# EAGLE design 6x6 (EAGLE 6.5.0)

## Sheet 1 of 2
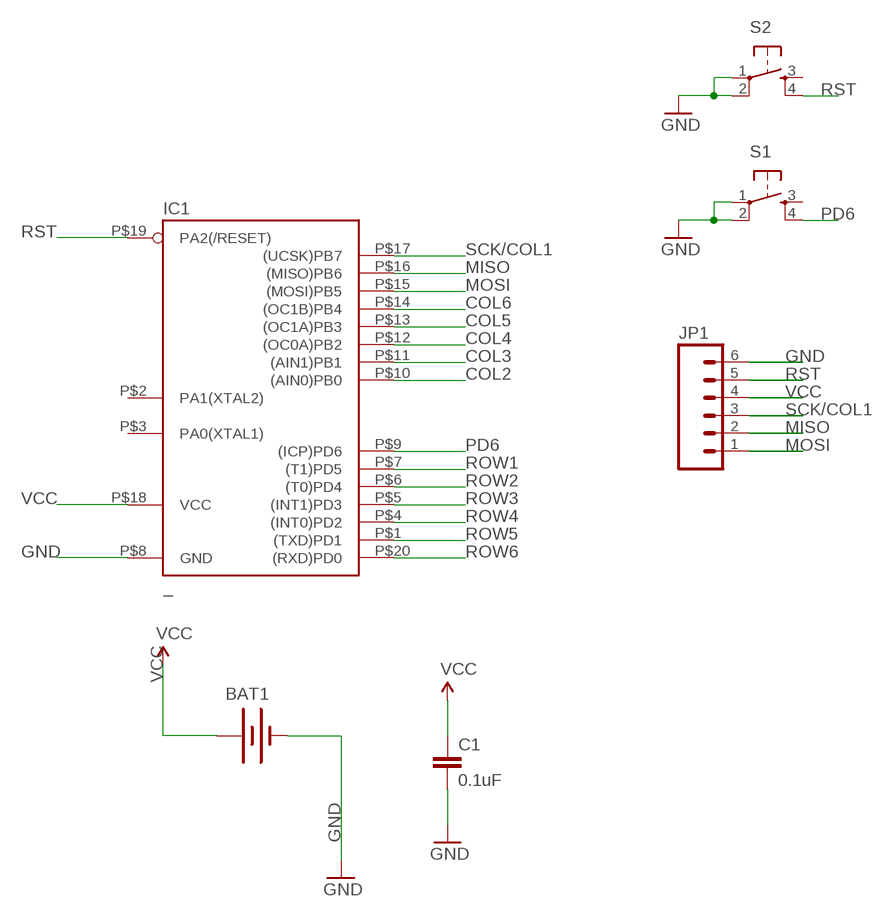
[diagram p0: schematic, sheet 1]

### Parts
BAT1  BATTERY245MM  [BATTCON_245MM]
C1  0.1uF  CAP0805  [0805]
IC1  _  TINY2313-*M*  [MLF20]
JP1  M061X06-SMD_EDGE_FEMALE  [1X06-SMD_EDGE]
S1  TAC_SWITCHSMD  [TACTILE_SWITCH_SMD]
S2  TAC_SWITCHSMD  [TACTILE_SWITCH_SMD]

### Nets
COL2: IC1.P$10((AIN0)PB0) ; also sheet 2
COL3: IC1.P$11((AIN1)PB1) ; also sheet 2
COL4: IC1.P$12((OC0A)PB2) ; also sheet 2
COL5: IC1.P$13((OC1A)PB3) ; also sheet 2
COL6: IC1.P$14((OC1B)PB4) ; also sheet 2
GND: BAT1.2(-) C1.2 IC1.P$8(GND) JP1.6 S1.1 S1.2 S2.1 S2.2 ; also sheet 2
MISO: IC1.P$16((MISO)PB6) JP1.2
MOSI: IC1.P$15((MOSI)PB5) JP1.1
PD6: IC1.P$9((ICP)PD6) S1.4
ROW1: IC1.P$7((T1)PD5) ; also sheet 2
ROW2: IC1.P$6((T0)PD4) ; also sheet 2
ROW3: IC1.P$5((INT1)PD3) ; also sheet 2
ROW4: IC1.P$4((INT0)PD2) ; also sheet 2
ROW5: IC1.P$1((TXD)PD1) ; also sheet 2
ROW6: IC1.P$20((RXD)PD0) ; also sheet 2
RST: IC1.P$19(PA2(/RESET)) JP1.5 S2.4
SCK/COL1: IC1.P$17((UCSK)PB7) JP1.3 ; also sheet 2
VCC: BAT1.3(+) C1.1 IC1.P$18(VCC) JP1.4 ; also sheet 2
Unconnected: IC1.P$2(PA1(XTAL2)) IC1.P$3(PA0(XTAL1)) S1.3 S2.3

## Sheet 2 of 2
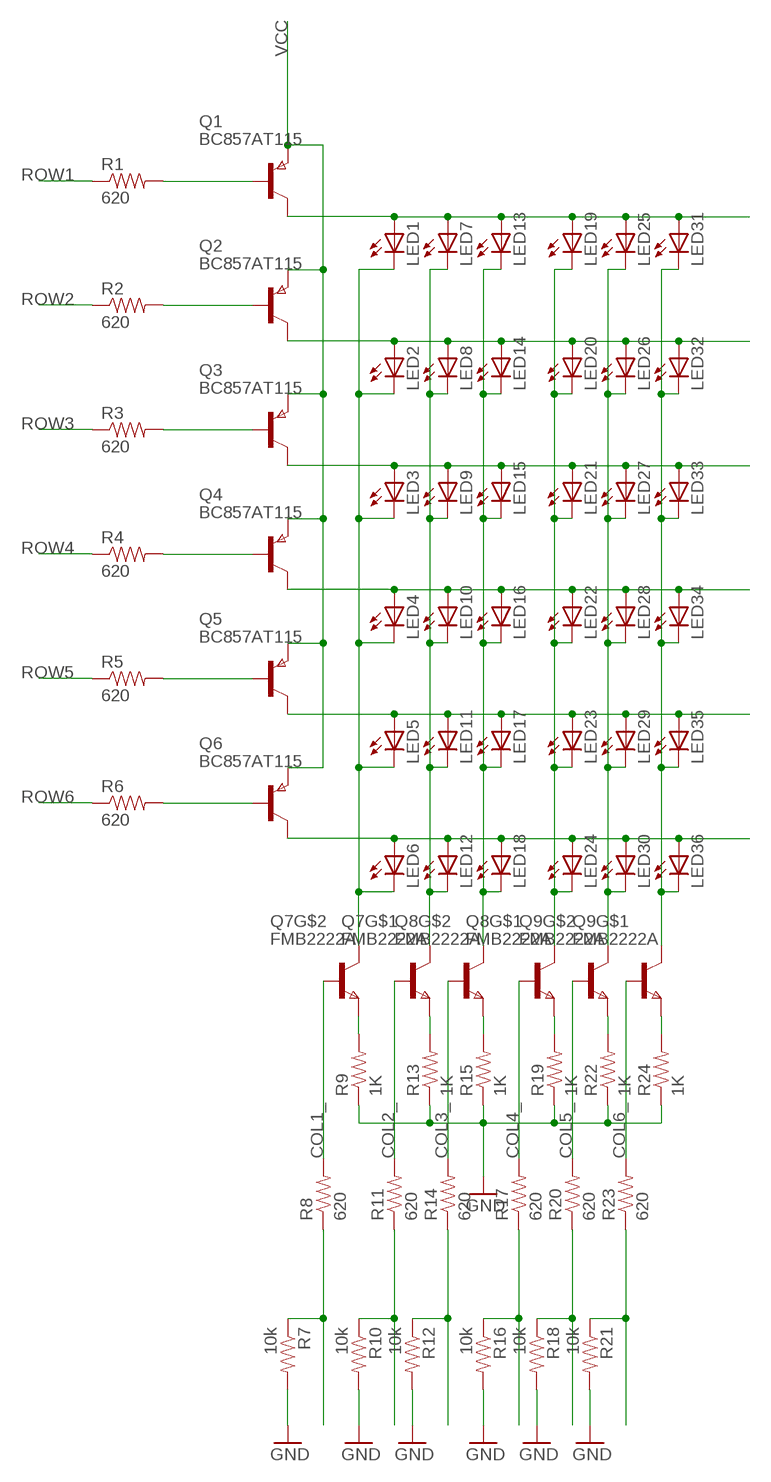
[diagram p1: schematic, sheet 2]

### Parts
LED1  LEDCHIPLED_1206  [CHIPLED_1206]
LED2  LEDCHIPLED_1206  [CHIPLED_1206]
LED3  LEDCHIPLED_1206  [CHIPLED_1206]
LED4  LEDCHIPLED_1206  [CHIPLED_1206]
LED5  LEDCHIPLED_1206  [CHIPLED_1206]
LED6  LEDCHIPLED_1206  [CHIPLED_1206]
LED7  LEDCHIPLED_1206  [CHIPLED_1206]
LED8  LEDCHIPLED_1206  [CHIPLED_1206]
LED9  LEDCHIPLED_1206  [CHIPLED_1206]
LED10  LEDCHIPLED_1206  [CHIPLED_1206]
LED11  LEDCHIPLED_1206  [CHIPLED_1206]
LED12  LEDCHIPLED_1206  [CHIPLED_1206]
LED13  LEDCHIPLED_1206  [CHIPLED_1206]
LED14  LEDCHIPLED_1206  [CHIPLED_1206]
LED15  LEDCHIPLED_1206  [CHIPLED_1206]
LED16  LEDCHIPLED_1206  [CHIPLED_1206]
LED17  LEDCHIPLED_1206  [CHIPLED_1206]
LED18  LEDCHIPLED_1206  [CHIPLED_1206]
LED19  LEDCHIPLED_1206  [CHIPLED_1206]
LED20  LEDCHIPLED_1206  [CHIPLED_1206]
LED21  LEDCHIPLED_1206  [CHIPLED_1206]
LED22  LEDCHIPLED_1206  [CHIPLED_1206]
LED23  LEDCHIPLED_1206  [CHIPLED_1206]
LED24  LEDCHIPLED_1206  [CHIPLED_1206]
LED25  LEDCHIPLED_1206  [CHIPLED_1206]
LED26  LEDCHIPLED_1206  [CHIPLED_1206]
LED27  LEDCHIPLED_1206  [CHIPLED_1206]
LED28  LEDCHIPLED_1206  [CHIPLED_1206]
LED29  LEDCHIPLED_1206  [CHIPLED_1206]
LED30  LEDCHIPLED_1206  [CHIPLED_1206]
LED31  LEDCHIPLED_1206  [CHIPLED_1206]
LED32  LEDCHIPLED_1206  [CHIPLED_1206]
LED33  LEDCHIPLED_1206  [CHIPLED_1206]
LED34  LEDCHIPLED_1206  [CHIPLED_1206]
LED35  LEDCHIPLED_1206  [CHIPLED_1206]
LED36  LEDCHIPLED_1206  [CHIPLED_1206]
Q1  BC857AT115  PNPSOT323SOT416  [SOT416]
Q2  BC857AT115  PNPSOT323SOT416  [SOT416]
Q3  BC857AT115  PNPSOT323SOT416  [SOT416]
Q4  BC857AT115  PNPSOT323SOT416  [SOT416]
Q5  BC857AT115  PNPSOT323SOT416  [SOT416]
Q6  BC857AT115  PNPSOT323SOT416  [SOT416]
Q7  FMB2222A  DUALNPN  [SSOT6]
Q8  FMB2222A  DUALNPN  [SSOT6]
Q9  FMB2222A  DUALNPN  [SSOT6]
R1  620  SPARKFUN_RESISTOR0402-RES  [SPARKFUN_0402-RES]
R2  620  SPARKFUN_RESISTOR0603-RES  [SPARKFUN_0603-RES]
R3  620  SPARKFUN_RESISTOR0603-RES  [SPARKFUN_0603-RES]
R4  620  SPARKFUN_RESISTOR0603-RES  [SPARKFUN_0603-RES]
R5  620  SPARKFUN_RESISTOR0603-RES  [SPARKFUN_0603-RES]
R6  620  SPARKFUN_RESISTOR0603-RES  [SPARKFUN_0603-RES]
R7  10k  SPARKFUN_RESISTOR0603-RES  [SPARKFUN_0603-RES]
R8  620  SPARKFUN_RESISTOR0603-RES  [SPARKFUN_0603-RES]
R9  1K  SPARKFUN_RESISTOR0603-RES  [SPARKFUN_0603-RES]
R10  10k  SPARKFUN_RESISTOR0603-RES  [SPARKFUN_0603-RES]
R11  620  SPARKFUN_RESISTOR0603-RES  [SPARKFUN_0603-RES]
R12  10k  SPARKFUN_RESISTOR0603-RES  [SPARKFUN_0603-RES]
R13  1K  SPARKFUN_RESISTOR0603-RES  [SPARKFUN_0603-RES]
R14  620  SPARKFUN_RESISTOR0603-RES  [SPARKFUN_0603-RES]
R15  1K  SPARKFUN_RESISTOR0603-RES  [SPARKFUN_0603-RES]
R16  10k  SPARKFUN_RESISTOR0603-RES  [SPARKFUN_0603-RES]
R17  620  SPARKFUN_RESISTOR0603-RES  [SPARKFUN_0603-RES]
R18  10k  SPARKFUN_RESISTOR0603-RES  [SPARKFUN_0603-RES]
R19  1K  SPARKFUN_RESISTOR0603-RES  [SPARKFUN_0603-RES]
R20  620  SPARKFUN_RESISTOR0603-RES  [SPARKFUN_0603-RES]
R21  10k  SPARKFUN_RESISTOR0603-RES  [SPARKFUN_0603-RES]
R22  1K  SPARKFUN_RESISTOR0603-RES  [SPARKFUN_0603-RES]
R23  620  SPARKFUN_RESISTOR0603-RES  [SPARKFUN_0603-RES]
R24  1K  SPARKFUN_RESISTOR0603-RES  [SPARKFUN_0603-RES]

### Nets
COL1_: Q7.3(B) R8.2
COL2: R10.1 R11.1 ; also sheet 1
COL2_: Q7.1(B) R11.2
COL3: R12.1 R14.1 ; also sheet 1
COL3_: Q8.3(B) R14.2
COL4: R16.1 R17.1 ; also sheet 1
COL4_: Q8.1(B) R17.2
COL5: R18.1 R20.1 ; also sheet 1
COL5_: Q9.3(B) R20.2
COL6: R21.1 R23.1 ; also sheet 1
COL6_: Q9.1(B) R23.2
GND: R7.2 R9.1 R10.2 R12.2 R13.1 R15.1 R16.2 R18.2 R19.1 R21.2 R22.1 R24.1 ; also sheet 1
LINE1: LED1.A LED7.A LED13.A LED19.A LED25.A LED31.A Q1.1(C)
LINE2: LED2.A LED8.A LED14.A LED20.A LED26.A LED32.A Q2.1(C)
LINE3: LED3.A LED9.A LED15.A LED21.A LED27.A LED33.A Q3.1(C)
LINE4: LED4.A LED10.A LED16.A LED22.A LED28.A LED34.A Q4.1(C)
LINE5: LED5.A LED11.A LED17.A LED23.A LED29.A LED35.A Q5.1(C)
LINE6: LED6.A LED12.A LED18.A LED24.A LED30.A LED36.A Q6.1(C)
N$1: Q2.2(B) R2.2
N$2: Q1.2(B) R1.2
N$3: Q5.2(B) R5.2
N$4: Q3.2(B) R3.2
N$5: Q4.2(B) R4.2
N$6: Q6.2(B) R6.2
N$7: LED19.C LED20.C LED21.C LED22.C LED23.C LED24.C Q8.6(C)
N$8: LED25.C LED26.C LED27.C LED28.C LED29.C LED30.C Q9.4(C)
N$9: LED31.C LED32.C LED33.C LED34.C LED35.C LED36.C Q9.6(C)
N$10: Q7.2(E) R9.2
N$11: Q9.5(E) R24.2
N$12: Q9.2(E) R22.2
N$13: Q8.5(E) R19.2
N$14: Q8.2(E) R15.2
N$15: Q7.5(E) R13.2
N$40: LED1.C LED2.C LED3.C LED4.C LED5.C LED6.C Q7.4(C)
N$41: LED7.C LED8.C LED9.C LED10.C LED11.C LED12.C Q7.6(C)
N$42: LED13.C LED14.C LED15.C LED16.C LED17.C LED18.C Q8.4(C)
ROW1: R1.1 ; also sheet 1
ROW2: R2.1 ; also sheet 1
ROW3: R3.1 ; also sheet 1
ROW4: R4.1 ; also sheet 1
ROW5: R5.1 ; also sheet 1
ROW6: R6.1 ; also sheet 1
SCK/COL1: R7.1 R8.1 ; also sheet 1
VCC: Q1.3(E) Q2.3(E) Q3.3(E) Q4.3(E) Q5.3(E) Q6.3(E) ; also sheet 1

## Library data of the parts
BAT1 = 6x6:BATTERY: Battery Holders Various common sizes : AA, AAA, 20mm coin cell and 12mm coin cell.
C1 = SparkFun:CAP: Capacitor Standard 0603 ceramic capacitor, and 0.1" leaded capacitor.
IC1 = NSL_Cylon:TINY2313*: Atmel Tiny2313 2K Flash, 128 bytes EEPROM, 128 bytes RAM
JP1 = SparkFun:M06: Header 6 Standard 6-pin 0.1" header. Use with straight break away headers (SKU : PRT-00116), right angle break away headers (PRT-00553), swiss pins (PRT-00743), machine pins (PRT-00117), and female headers (PRT-00115). Molex polarized connector foot print use with SKU : PRT-08094 with associated crimp pins and housings. NOTES ON THE VARIANTS LOCK and LOCK_LONGPADS... This footprint was designed to help hold the alignment of a through-hole component (i.e. 6-pin header) while soldering it into place. You may notice that each hole has been shifted either up or down by 0.005 of an inch from it's more standard position (which is a perfectly straight line). This slight alteration caused the pins (the squares in the middle) to touch the edges of the holes. Because they are alternating, it causes a "brace" to hold the component in place. 0.005 has proven to be the perfect amount of "off-center" position when using our standard breakaway headers. Although looks a little odd when you look at the bare footprint, once you have a header in there, the alteration is very hard to notice. Also, if you push a header all the way into place, it is covered up entirely on the bottom side. This idea of altering the position of holes to aid alignment will be further integrated into the Sparkfun Library for other footprints. It can help hold any component with 3 or more connection pins.
LED1-LED36 = led:LED: LED OSRAM: - CHIPLED LG R971, LG N971, LY N971, LG Q971, LY Q971, LO R971, LY R971 LH N974, LH R974 LS Q976, LO Q976, LY Q976 LO Q996 - Hyper CHIPLED LW Q18S LB Q993, LB Q99A, LB R99A - SideLED LS A670, LO A670, LY A670, LG A670, LP A670 LB A673, LV A673, LT A673, LW A673 LH A674 LY A675 LS A676, LA A676, LO A676, LY A676, LW A676 LS A679, LY A679, LG A679 - Hyper Micro SIDELED® LS Y876, LA Y876, LO Y876, LY Y876 LT Y87S - SmartLED LW L88C, LW L88S LB L89C, LB L89S, LG L890 LS L89K, LO L89K, LY L89K LS L896, LA L896, LO L896, LY L896 - TOPLED LS T670, LO T670, LY T670, LG T670, LP T670 LSG T670, LSP T670, LSY T670, LOP T670, LYG T670 LG T671, LOG T671, LSG T671 LB T673, LV T673, LT T673, LW T673 LH T674 LS T676, LA T676, LO T676, LY T676, LB T676, LH T676, LSB T676, LW T676 LB T67C, LV T67C, LT T67C, LS T67K, LO T67K, LY T67K, LW E67C LS E67B, LA E67B, LO E67B, LY E67B, LB E67C, LV E67C, LT E67C LW T67C LS T679, LY T679, LG T679 LS T770, LO T770, LY T770, LG T770, LP T770 LB T773, LV T773, LT T773, LW T773 LH T774 LS E675, LA E675, LY E675, LS T675 LS T776, LA T776, LO T776, LY T776, LB T776 LHGB T686 LT T68C, LB T68C - Hyper Mini TOPLED® LB M676 - Mini TOPLED Santana® LG M470 LS M47K, LO M47K, LY M47K Source: http://www.osram.convergy.de LUXEON: - LUMILED® LXK2-PW12-R00, LXK2-PW12-S00, LXK2-PW14-U00, LXK2-PW14-V00 LXK2-PM12-R00, LXK2-PM12-S00, LXK2-PM14-U00 LXK2-PE12-Q00, LXK2-PE12-R00, LXK2-PE12-S00, LXK2-PE14-T00, LXK2-PE14-U00 LXK2-PB12-K00, LXK2-PB12-L00, LXK2-PB12-M00, LXK2-PB14-N00, LXK2-PB14-P00, LXK2-PB14-Q00 LXK2-PR12-L00, LXK2-PR12-M00, LXK2-PR14-Q00, LXK2-PR14-R00 LXK2-PD12-Q00, LXK2-PD12-R00, LXK2-PD12-S00 LXK2-PH12-R00, LXK2-PH12-S00 LXK2-PL12-P00, LXK2-PL12-Q00, LXK2-PL12-R00 Source: www.luxeon.com KINGBRIGHT: KA-3528ASYC Source: www.kingbright.com
Q1-Q6 = zetex:PNPSOT323: PNP TRANSISTOR
Q7-Q9 = fairchild-semic:DUALNPN
R1-R24 = Nullspace:SPARKFUN_RESISTOR: Resistor Basic schematic elements and footprints for 0603, 1206, and PTH 1/10th watt (small) resistors.
S1 S2 = SparkFun:TAC_SWITCH: Momentary Switch Button commonly used for reset or general input. Spark Fun Electronics SKU : COM-00097

## Net classes
1 power: width 0.254 mm
2 leds: width 0.508 mm

## Board
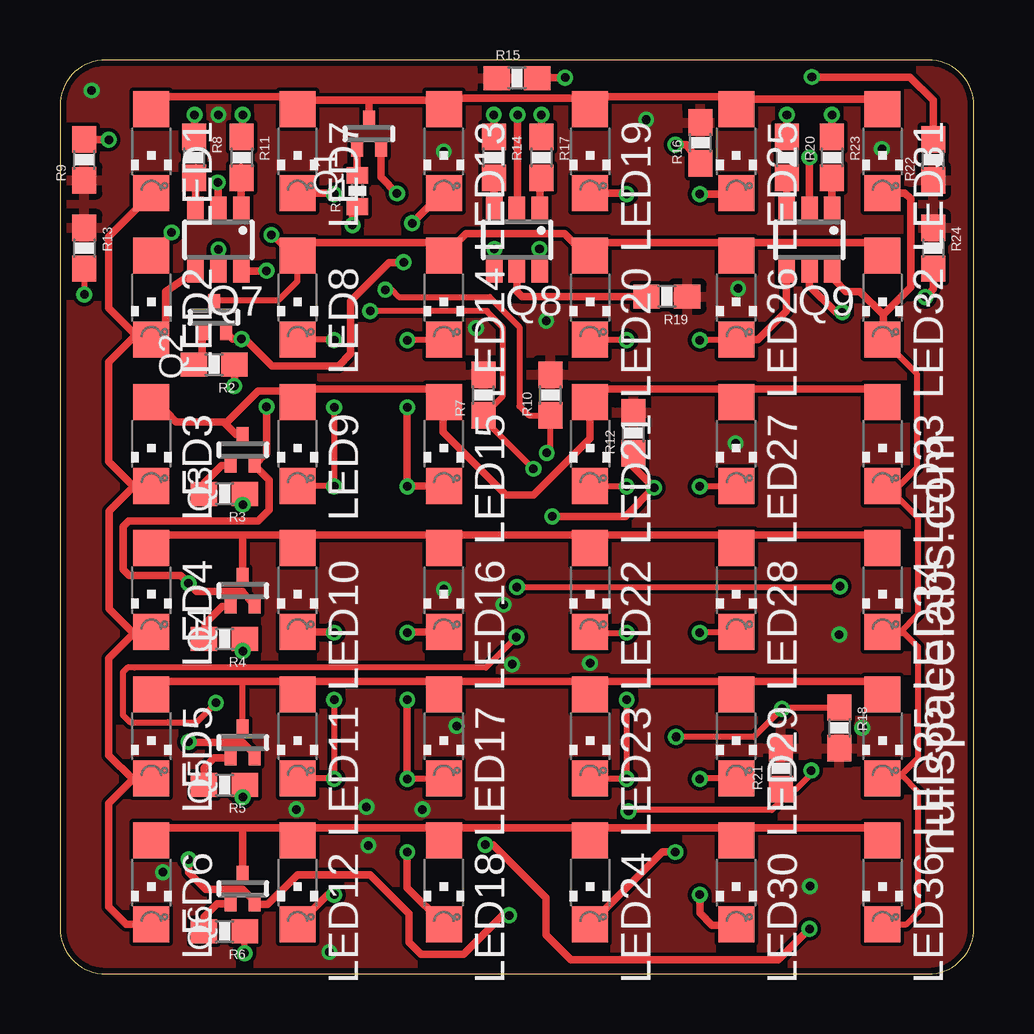
[diagram p2: board, top side]
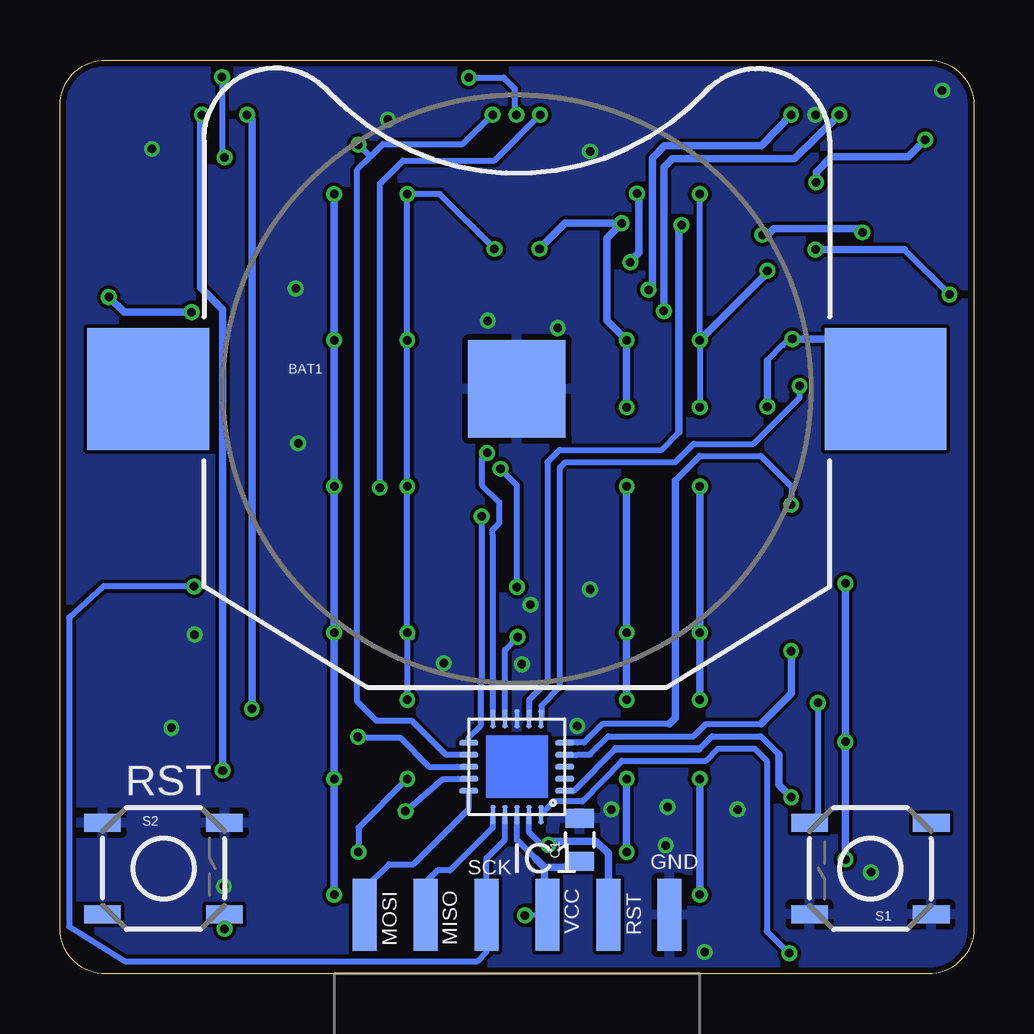
[diagram p3: board, bottom side, seen from below]

Size 38.1 x 38.1 mm. Coordinates in mm from the lower left corner, seen from the top.
Outline: 0,36.2 0,1.91 arc90 1.91,0 36.2,0 arc90 38.1,1.91 38.1,36.2 arc90 36.2,38.1 1.91,38.1 arc90 0,36.2
Copper layers (1*16): Top 0.035mm / dielectric 1.5mm / Bottom 0.035mm
Design rules "ITEADstudio_DRC": minimum track width 6mil, minimum drill 12mil, track to track 6mil, track to pad 6mil, pad to pad 6mil, via to via 6mil, smd to smd 0mil, copper to edge 10mil, drill to drill 10mil, minimum pad ring 10mil, minimum via ring 6mil, stop-mask expansion 2mil, vias tented up to drill 100mil, thermal gap 10mil

### Footprints (pad centres in the part's own frame; a part is rotated, then mirrored left to right if it is on the bottom)
BATTCON_245MM = smd 5.08 x 5.08: 1 -15.367,0; 3 15.367,0 | smd 4.064 x 4.064: 2 0,0
0805 = smd 0.8 x 1.2: 1 -0.9,0; 2 0.9,0
MLF20 = smd 0.8 x 0.23: P$1 -2,1; P$2 -2,0.5; P$3 -2,0; P$4 -2,-0.5; P$5 -2,-1; P$11 2,-1; P$12 2,-0.5; P$13 2,0; P$14 2,0.5; P$15 2,1 | smd 0.23 x 0.8: P$6 -1,-2; P$7 -0.5,-2; P$8 0,-2; P$9 0.5,-2; P$10 1,-2; P$16 1,2; P$17 0.5,2; P$18 0,2; P$19 -0.5,2; P$20 -1,2
1X06-SMD_EDGE = smd 1 x 3: 1 0,-0.08; 2 2.54,-0.08; 3 5.08,-0.08; 4 7.62,-0.08; 5 10.16,-0.08; 6 12.7,-0.08
CHIPLED_1206 = smd 1.5 x 1.5: A 0,-1.75; C 0,1.75
SOT416 = smd 0.6 x 0.5: 1 -0.65,0; 2 0.65,-0.5; 3 0.65,0.5
SSOT6 = smd 0.69 x 0.99: 1 -0.95,-1.3; 2 0,-1.3; 3 0.95,-1.3; 4 0.95,1.3; 5 0,1.3; 6 -0.95,1.3
SPARKFUN_0402-RES = smd 0.7 x 0.9: 1 -0.65,0; 2 0.65,0
SPARKFUN_0603-RES = smd 1.1 x 1: 1 -0.85,0; 2 0.85,0
TACTILE_SWITCH_SMD = smd 1.524 x 0.762: 1 -2.54,1.905; 2 2.54,1.905; 3 -2.54,-1.905; 4 2.54,-1.905

### Placement (x,y rotation side)
BAT1  19.05,24.38 0 bottom
C1  16.43,5.59 90 bottom
IC1  19.05,8.64 180 bottom
JP1  25.4,2.54 0 bottom
LED1  3.81,34.29 180 top
LED2  3.81,28.19 180 top
LED3  3.81,22.1 180 top
LED4  3.81,16 180 top
LED5  3.81,9.91 180 top
LED6  3.81,3.81 180 top
LED7  9.91,34.29 180 top
LED8  9.91,28.19 180 top
LED9  9.91,22.1 180 top
LED10  9.91,16 180 top
LED11  9.91,9.91 180 top
LED12  9.91,3.81 180 top
LED13  16,34.29 180 top
LED14  16,28.19 180 top
LED15  16,22.1 180 top
LED16  16,16 180 top
LED17  16,9.91 180 top
LED18  16,3.81 180 top
LED19  22.1,34.29 180 top
LED20  22.1,28.19 180 top
LED21  22.1,22.1 180 top
LED22  22.1,16 180 top
LED23  22.1,9.91 180 top
LED24  22.1,3.81 180 top
LED25  28.19,34.29 180 top
LED26  28.19,28.19 180 top
LED27  28.19,22.1 180 top
LED28  28.19,16 180 top
LED29  28.19,9.91 180 top
LED30  28.19,3.81 180 top
LED31  34.29,34.29 180 top
LED32  34.29,28.19 180 top
LED33  34.29,22.1 180 top
LED34  34.29,16 180 top
LED35  34.29,9.91 180 top
LED36  34.29,3.81 180 top
Q1  12.88,35.03 270 top
Q2  6.43,27.38 270 top
Q3  7.62,21.84 270 top
Q4  7.62,15.98 270 top
Q5  7.62,9.65 270 top
Q6  7.62,3.56 270 top
Q7  6.6,30.61 180 top
Q8  19.05,30.61 180 top
Q9  31.24,30.61 180 top
R1  12.4,32.64 90 top
R2  6.43,25.4 180 top
R3  6.86,20.02 180 top
R4  6.86,13.97 180 top
R5  6.86,7.87 180 top
R6  6.86,1.78 180 top
R7  17.65,24.13 90 top
R8  5.59,34.04 270 top
R9  1.02,33.93 90 top
R10  20.45,24.13 90 top
R11  7.57,34.04 270 top
R12  23.9,22.56 90 top
R13  1.02,30.25 270 top
R14  18.08,34.04 270 top
R15  19.05,37.34 0 top
R16  26.7,34.65 90 top
R17  20.07,34.04 270 top
R18  32.49,10.26 270 top
R19  25.3,28.24 180 top
R20  30.3,34.04 270 top
R21  30.05,8.56 90 top
R22  36.4,33.93 90 top
R23  32.18,34.04 270 top
R24  36.4,30.25 270 top
S1  4.32,4.39 180 bottom
S2  33.78,4.39 0 bottom

### Tracks (layer width: path | path; a pad name or v marks a point on that pad's centre or on a via)
COL1_
  Top 0.254: R8.2 5.65,33.6
  Top 0.305: 5.65,33.6 Q7.3
COL2  (via drill 0.36)
  Top 0.254: v13.56,28.52 13.82,28.52 14.12,28.22 17.91,28.22 19.15,26.98 19.15,23.67 19.54,23.28 R10.1 | 7.62,34.99 R11.1 | R10.1 20.61,23.47 | 20.61,23.27 R10.1 | v20.3,21.72 20.45,21.87 R10.1
  Top 0.305: v7.62,35.81 7.62,34.99
  Bottom 0.203: 20.07,10.65 IC1.P$10
  Bottom 0.254: v13.56,28.52 13.41,28.68 | v20.3,21.72 20.5,21.51 20.5,20.37 19.79,19.66 19.79,18.8 20.07,18.52 20.07,18.29 20.07,11.18 20.07,10.65 IC1.P$10
  Bottom 0.305: 13.41,28.68 13.41,34.01 12.9,34.52 8.87,34.52 v7.62,35.81
COL2_
  Top 0.254: R11.2 7.55,33.62
  Top 0.305: 7.55,33.62 Q7.1
COL3  (via drill 0.36)
  Top 0.305: v20.52,19.07 23.57,19.07 v24.77,20.27 23.9,21.13 R12.1 | v18.09,35.81 R14.1
  Bottom 0.203: 21.08,9.63 IC1.P$11
  Bottom 0.254: 21.08,9.63 21.08,9.83 20.57,10.34 20.57,12.14 20.52,12.19 v20.52,19.07 | v24.77,20.27 24.77,32.94 23.8,33.91 19.99,33.91 v18.09,35.81
COL3_
  Top 0.305: R14.2 18.1,33.17 Q8.3
COL4  (via drill 0.36)
  Top 0.305: v20.07,35.81 R17.1 | R16.1 26.12,34.57 v25.65,34.57
  Bottom 0.203: IC1.P$12
  Bottom 0.254: 25.16,34.07 25.71,33.53 25.71,11.35 24.92,10.57 23.44,10.57 22.02,9.14 21.51,9.14 IC1.P$12 | 25.16,34.07 24.64,34.59 21.31,34.59 v20.07,35.81 | 25.16,34.07 v25.65,34.57
COL4_
  Top 0.305: R17.2 20,33.12 Q8.1
COL5  (via drill 0.36)
  Top 0.254: v25.68,9.88 28.93,9.88 v30.1,11.05 | v30.1,11.05 30.19,11.14 | R18.1 30.16,11.11 v30.1,11.05
  Top 0.305: v30.3,35.81 R20.1
  Bottom 0.254: IC1.P$13 21.54,8.64 22.71,8.64 23.93,9.86 25.65,9.86 v25.68,9.88
  Bottom 0.305: v30.1,11.05 30.1,35.61 v30.3,35.81
COL5_
  Top 0.305: Q9.3 30.3,32.54 R20.2
COL6  (via drill 0.36)
  Top 0.254: R21.1 29.95,7.81 | R21.1 30.7,7.71 31.32,8.33 v31.32,8.48 | v23.7,6.78 23.75,6.83 29.67,6.83 30.05,7.21 R21.1
  Top 0.305: v32.18,35.81 R23.1
  Bottom 0.203: 21.51,8.13 21.51,8.14
  Bottom 0.254: 21.51,8.14 IC1.P$14 | 21.51,8.13 22.12,8.13 v23.7,6.78
  Bottom 0.305: v32.18,35.81 32.23,35.76 32.23,28.6 31.32,27.69 v31.32,8.48
COL6_
  Top 0.305: Q9.1 32.18,32.54 R23.2
GND  (via drill 0.36)
  other vias: 18.49,15.39 12.78,6.96 20.27,27.23 6.6,35.81 17.35,26.92 15.11,6.86 1.32,36.83 28.27,28.58 34.26,34.39 33.45,10.26 22.1,12.95 28.17,22.12 16,34.29 12.85,5.36 11.23,0.91 24.43,35.61 31.27,3.66 4.29,4.24 18.85,12.9 9.86,6.86 32.49,14.15 16.54,10.34 16,16.03
  pour Bottom (isolate 0.127): 38.61,38.61 38.61,-0.25 -0.25,-0.25 -0.25,36.07 arc-90 2.29,38.61
  pour Top (isolate 0.076): -0.25,-0.25 -0.25,38.35 38.35,38.35 38.35,-0.25
LINE1
  Top 0.254: LED1.A 3.81,36.07 4.32,36.58 | 9.91,36.58 LED7.A 9.91,36.07 10.39,36.42 | 15.54,36.5 LED13.A 15.61,36.04 | 21.64,36.5 LED19.A 22.1,36.32 22.35,36.58 | 28.19,36.58 LED25.A 28.19,36.07 28.73,36.47 | 33.78,36.47 LED31.A
  Top 0.305: 4.32,36.58 9.91,36.58 | 21.64,36.5 15.54,36.5 15.47,36.42 12.88,36.42 | 22.35,36.58 28.19,36.58 | 28.73,36.47 33.78,36.47 | 10.39,36.42 12.88,36.42 | Q1.1 12.88,36.42
LINE2  (via drill 0.36)
  Top 0.203: LED8.A 9.91,29.44 | 10.82,30.48 11.33,30.48 | 6.49,28.09 arc90 Q2.1
  Top 0.254: 3.81,29.97 LED2.A v4.65,30.91 | LED8.A 9.91,29.97 | LED8.A 10.41,30.45 10.41,30.48 | 16,30.48 LED14.A 16.51,30.45 16.51,30.48 | LED20.A 22.1,29.97 | LED20.A 22.61,30.45 22.61,30.48 | 27.94,30.48 28.19,30.23 LED26.A | 34.29,29.97 LED32.A 34.24,29.94 | v8.81,30.81 9.68,29.94 LED8.A | 21.95,29.94 LED20.A | 6.49,28.09 9.12,28.09 9.91,28.88 9.91,29.44
  Top 0.305: 10.41,30.48 10.82,30.48 16,30.48 | 22.61,30.48 27.94,30.48 | 16.51,30.45 16.92,30.86 21.03,30.86 21.95,29.94 | LED26.A 28.73,30.48 33.71,30.48 34.24,29.94 LED32.A
  Bottom 0.305: v4.65,30.91 4.8,31.06 8.33,31.06 8.59,30.81 v8.81,30.81
LINE3
  Top 0.254: LED3.A 4.32,24.36 4.32,24.38 4.42,24.28 4.42,23.44 | 10.41,24.38 10.41,24.36 LED9.A 9.91,23.88 9.4,24.38 9.32,24.31 | 15.49,24.38 16,23.88 LED15.A | 28.7,24.38 28.7,24.36 LED27.A 28.19,24.38 | 34.04,24.38 34.29,24.13 LED33.A | 22.1,23.62 LED21.A 22.61,24.36 22.61,24.38 | 6.96,23.01 6.83,23.01
  Top 0.305: 15.49,24.38 10.41,24.38 | 28.7,24.38 34.04,24.38 | 22.61,24.38 28.19,24.38 | Q3.1 7.35,22.49 6.83,23.01 4.85,23.01 4.42,23.44 | 9.32,24.31 8.26,24.31 6.96,23.01 | 22.1,23.62 22.1,22.33 19.74,19.96 18.59,19.96 15.98,22.58 15.98,23.82 LED15.A
LINE4
  Top 0.254: LED4.A 4.32,18.26 4.32,18.29 | 9.91,18.03 9.65,18.29 | 9.91,18.03 LED10.A | 10.16,18.29 9.91,18.03 | 16.26,18.29 16,18.03 LED16.A | 21.84,18.29 21.84,18.01 LED22.A 22.61,18.26 22.61,18.29 | 27.69,18.29 28.19,17.78 LED28.A 28.7,18.26 28.7,18.29 | 34.29,18.29 LED34.A | 7.62,18.26 7.65,18.29
  Top 0.305: 9.65,18.29 7.65,18.29 6.86,18.29 4.32,18.29 | 10.16,18.29 16.26,18.29 21.84,18.29 | 22.61,18.29 27.69,18.29 | 28.7,18.29 34.29,18.29 | Q4.1 7.62,18.26
LINE5
  Top 0.203: Q5.1 7.61,10.31
  Top 0.254: LED5.A 4.32,12.16 4.32,12.19 | 9.91,12.19 LED11.A | 15.49,12.19 15.49,12.16 LED17.A 16,11.94 | 21.56,12.19 LED23.A 22.61,12.16 22.61,12.19 | 27.94,12.19 28.19,11.94 LED29.A 28.73,12.19 | 34.04,12.19 34.29,11.94 LED35.A | 7.61,10.31 7.61,12.13 7.54,12.19
  Top 0.305: 4.32,12.19 6.48,12.19 7.54,12.19 9.91,12.19 15.49,12.19 | 21.56,12.19 16.26,12.19 16,11.94 | 27.94,12.19 22.61,12.19 | 28.73,12.19 34.04,12.19
LINE6
  Top 0.254: LED6.A 4.32,6.07 4.32,6.1 | 9.91,5.84 9.65,6.1 | 9.91,5.84 LED12.A | 10.16,6.1 9.91,5.84 | 15.75,6.1 16,5.84 LED18.A 16.54,6.1 | 22.1,6.1 LED24.A 22.61,6.07 22.61,6.1 | 28.19,6.1 LED30.A 28.73,6.1 | LED36.A 34.29,6.1 | 7.62,6.04 7.67,6.1
  Top 0.305: 9.65,6.1 7.67,6.1 6.81,6.1 4.32,6.1 | 15.75,6.1 10.16,6.1 | 28.19,6.1 22.61,6.1 | 34.29,6.1 28.73,6.1 | 22.1,6.1 16.54,6.1 | Q6.1 7.62,6.04
MISO
  Bottom 0.254: IC1.P$16 20.07,6.62 20.07,6.1 21.84,4.32 22.35,4.32 22.86,3.81 JP1.2
MOSI
  Bottom 0.254: IC1.P$15 21.05,6.89 23.37,4.57 24.38,4.57 25.15,3.81 25.15,2.71 JP1.1
N$1
  Top 0.203: 5.93,25.75 arc-90 R2.2
  Top 0.305: Q2.2 5.93,25.75
N$2
  Top 0.254: R1.2 12.38,33.31
  Top 0.305: 12.38,33.31 Q1.2
N$3
  Top 0.203: 6.02,7.89 R5.2
  Top 0.305: Q5.2 6.44,9 6.02,8.59 6.02,7.89
N$4
  Top 0.203: R3.2
  Top 0.305: R3.2 6.02,20.47 6.74,21.19 Q3.2
N$5
  Top 0.254: 6.04,14.01 R4.2
  Top 0.305: 6.04,14.01 6.04,14.61 6.77,15.33 Q4.2
N$6
  Top 0.203: 6.02,2.16 6.01,2.15 | Q6.2 7.11,2.92
  Top 0.305: 6.01,2.15 R6.2 | 6.02,2.16 6.02,2.39 6.55,2.92 7.11,2.92
N$7  (via drill 0.36)
  Top 0.254: LED23.C 22.13,8.13 v23.62,8.13 v23.62,11.43 | LED22.C 22.13,14.22 v23.62,14.22 | LED21.C 22.13,20.32 v23.62,20.32 | LED20.C 22.13,26.42 v23.62,26.42 | 20,28.94 Q8.6
  Top 0.305: LED19.C 23.59,32.54 v23.62,32.51 | v25.65,5.08 25.12,5.08 LED24.C | Q8.6 v19.99,30.23
  Bottom 0.203: v23.62,14.22 arc90 23.42,14.02
  Bottom 0.254: v25.65,5.08 25.65,6.1 v23.62,8.13 | v23.62,11.43 v23.62,14.22 v23.62,20.32 v23.62,26.42 v23.62,32.51 22.28,32.51 v19.99,30.23
N$8  (via drill 0.36)
  Top 0.254: 28.19,32.51 LED25.C | 28.17,2.03 LED30.C | LED29.C 26.7,8.16 v26.67,8.13 | LED28.C 26.9,14.25 v26.67,14.22 | LED27.C 26.7,20.35 v26.67,20.32 | LED26.C 26.7,26.44 v26.67,26.42 | 30.29,29.53 Q9.4
  Top 0.305: v26.67,32.51 28.19,32.51 | v26.67,3.3 26.67,2.54 27.18,2.03 28.17,2.03 | 30.29,29.53 30.28,29.52 30.28,27.64 29.09,26.44 LED26.C
  Bottom 0.305: v26.67,3.3 v26.67,8.13 v26.67,14.22 v26.67,20.32 v26.67,26.42 v26.67,32.51
N$9
  Top 0.254: 34.32,8.13 LED35.C 34.31,8.18 34.95,8.18 35.06,8.29 | LED34.C 34.32,14.22 35,14.22 | LED33.C 34.32,20.32 34.95,20.32 | 34.31,26.47 LED32.C 34.32,26.42 34.32,26.41 35.71,25.02 35.71,21.08 34.95,20.32 | Q9.6 32.19,29.02 32.26,28.96 | 34.95,20.32 34.95,19.84 35.76,19.03 35.76,14.99 35,14.22 | 35,14.22 35.18,14.22 35.76,13.64 35.76,8.99 35.06,8.29 | LED36.C 35.25,2.06 35.79,2.59 35.79,7.57 35.06,8.29
  Top 0.305: 32.26,28.96 32.77,28.45 33.35,28.45 34.31,27.48 | 34.31,27.48 34.31,26.47 | LED31.C 35.23,32.54 35.46,32.31 35.46,28.63 34.31,27.48
N$10  (via drill 0.36)
  Top 0.254: 2.02,34.78 v2.03,34.77
  Top 0.305: R9.2 2.02,34.78 | v6.58,33 6.6,32.97 Q7.2
  Bottom 0.305: v2.03,34.77 2.74,34.06 5.94,34.06 6.58,33.43 v6.58,33
N$11  (via drill 0.36)
  Top 0.305: v32.61,27.58 32.33,27.58 31.24,28.68 Q9.5 | R24.2 36.4,28.55 v36.07,28.22
  Bottom 0.305: v32.61,27.58 35.43,27.58 v36.07,28.22
N$12  (via drill 0.36)
  Top 0.305: v31.24,34.04 Q9.2 | v31.34,37.39 35.43,37.39 36.4,36.42 R22.2
  Bottom 0.254: v31.34,37.39 31.34,34.14 v31.24,34.04
N$13
  Top 0.305: R19.2 19.25,28.25 19.05,28.45 Q8.5
N$14  (via drill 0.36)
  Top 0.254: 19.07,31.93 Q8.2
  Top 0.305: v19.07,35.81 19.07,31.93 | R15.2 19.98,37.36 v21.06,37.36
  Bottom 0.254: v21.06,37.36 19.61,37.36 19.15,36.91 19.15,35.87 v19.07,35.81
N$15  (via drill 0.36)
  Top 0.254: R13.2 v1.02,28.32
  Top 0.305: v6.6,30.2 Q7.5
  Bottom 0.254: v1.02,28.32 2.9,30.2
  Bottom 0.305: 2.9,30.2 v6.6,30.2
N$40
  Top 0.254: LED1.C 3.3,32.03 3.3,32 | 3.78,8.13 LED5.C 3.76,8.1 3.02,8.1 3.02,8.13 | 3.78,14.22 LED4.C 3.76,14.2 3.07,14.2 | 3.78,20.32 LED3.C 3.78,20.32 | LED2.C 3.58,26.67 3.33,26.67 3.23,26.57 3.1,26.57 | 3.07,20.32 3.78,20.32
  Top 0.305: 3.3,32 2.03,30.73 2.03,27.76 3.23,26.57 | LED6.C 2.77,2.06 2.03,2.79 2.03,7.11 3.02,8.1 | Q7.4 4.41,28.45 4.41,27.05 LED2.C | 3.02,8.13 2.03,9.12 2.03,13.16 3.07,14.2 2.06,15.21 2.06,19.3 3.07,20.32 2.03,21.36 2.03,25.5 3.1,26.57
N$41  (via drill 0.36)
  Top 0.254: LED11.C 11.4,8.16 v11.43,8.13 v11.43,11.43 | v11.43,14.22 11.4,14.25 | LED9.C 11.4,20.35 v11.43,20.32 v11.43,23.62 | LED8.C 11.4,26.44 v11.43,26.42 | v8.61,29.31
  Top 0.305: LED7.C 11.4,32.54 v11.43,32.51 | v11.43,3.3 11.15,3.3 LED12.C | 11.4,14.25 LED10.C | Q7.6 v8.61,29.31
  Bottom 0.254: v11.43,32.51 v11.43,26.42 v11.43,23.62
  Bottom 0.305: v11.43,8.13 v11.43,3.3 | v11.43,20.32 v11.43,14.22 v11.43,11.43 | v11.43,26.42 8.61,29.23 v8.61,29.31
N$42  (via drill 0.36)
  Top 0.203: 18.11,29.3 Q8.4
  Top 0.254: 15.97,32.51 LED13.C 15.93,32.54 | LED17.C 14.51,8.16 v14.48,8.13 | v14.48,20.32 14.7,20.35 | LED14.C 14.51,26.44 v14.48,26.42 | v18.11,30.23 18.1,30.22
  Top 0.305: v14.48,5.08 14.48,3.58 LED18.C | LED16.C 14.51,14.25 v14.48,14.22 | 14.7,20.35 LED15.C | v14.48,11.43 v14.48,8.13 | v14.48,23.62 v14.48,20.32 | v14.68,31.29 15.93,32.54 | 18.1,30.22 Q8.4
  Bottom 0.305: v14.48,8.13 v14.48,5.08 | v14.48,20.32 v14.48,14.22 v14.48,11.43 | v14.48,23.62 v14.48,26.42 15.29,27.23 15.29,30.68 v14.68,31.29 17.04,31.29 v18.11,30.23
PD6  (via drill 0.36)
  Top 0.254: v19.03,14.05 17.76,12.78 3.1,12.78 2.82,12.78 2.62,12.57 2.62,10.79 2.92,10.49 4.5,10.49 5.69,10.49 v6.5,11.3
  Bottom 0.254: IC1.P$9 19.56,11.46 19.56,13.51 v19.03,14.05 | v6.5,11.3 6.5,6.66 S1.4
ROW1  (via drill 0.36)
  Top 0.305: R1.1 12.19,31.79 v12.19,31.22
  Bottom 0.203: IC1.P$7
  Bottom 0.254: 12.29,22.58 13.03,21.84 17.27,21.84 17.78,21.34 17.78,12.19 18.54,11.43 18.54,11.18 IC1.P$7 | 12.29,31.22 v12.19,31.22
  Bottom 0.305: 12.29,22.58 12.29,31.22
ROW2  (via drill 0.36)
  Top 0.305: R2.1 7.28,24.52 v7.26,24.51
  Bottom 0.203: 18.03,10.65 IC1.P$6
  Bottom 0.254: v7.26,24.51 7.26,24.03 9.2,22.1 11.68,22.1 12.45,21.34 17.02,21.34 17.27,21.08 17.27,11.94 18.03,11.18 18.03,10.65 IC1.P$6
ROW3  (via drill 0.36)
  Top 0.254: v7.62,19.56 7.51,19.67 R3.1
  Bottom 0.254: IC1.P$5 17.05,9.65 16.51,9.65 16.26,9.65 15.49,10.41 12.7,10.41 | 12.45,20.57 11.43,21.59 8.89,21.59 7.62,20.32 v7.62,19.56
  Bottom 0.305: 12.7,10.41 12.45,10.67 12.45,20.57
ROW4  (via drill 0.36)
  Top 0.254: R4.1 7.62,13.88 v7.62,13.46
  Bottom 0.203: 16.52,9.14 16.51,9.14
  Bottom 0.254: IC1.P$4 16.52,9.14 | 16.51,9.14 16,9.14 15.24,9.91 11.68,9.91 11.18,10.41 8.89,10.41
  Bottom 0.305: 8.89,10.41 7.62,11.68 v7.62,13.46
ROW5  (via drill 0.36)
  Top 0.203: R5.1 7.71,7.45 v7.62,7.37
  Bottom 0.203: IC1.P$1 | 16.67,7.64 16.66,7.65
  Bottom 0.254: 8.13,9.14 8.89,9.91 10.92,9.91 11.43,9.4 11.46,9.37 | IC1.P$1 16.67,7.64 | 16.66,7.65 14.94,9.37
  Bottom 0.305: 8.13,9.14 8.13,7.87 v7.62,7.37 | 14.94,9.37 11.46,9.37
ROW6  (via drill 0.36)
  Top 0.254: 7.51,1.38 R6.1 7.71,0.88 v7.7,0.86
  Bottom 0.254: 18.03,6.64 IC1.P$20 17.5,7.19 16.33,7.19 16.28,7.24 14.68,8.89 11.18,8.89 10.67,9.4 9.14,9.4 8.64,8.89 8.64,1.78 7.72,0.86 v7.7,0.86
RST  (via drill 0.36)
  Top 0.305: v31.24,1.88 29.95,0.58 21.31,0.58 20.27,1.63 20.27,3.18 18.06,5.39 v17.73,5.39
  Bottom 0.254: v17.73,5.39 18.03,5.39 18.54,5.89 18.54,6.63 IC1.P$19
  Bottom 0.305: S2.4 v31.24,1.88 | JP1.5 15.24,5.03 15.75,5.54 17.58,5.54 v17.73,5.39
SCK/COL1  (via drill 0.36)
  Top 0.254: 17.78,27.64 v12.93,27.64 | 17.78,27.64 17.8,27.64 | 5.61,34.97 R8.1 | R7.1 17.49,23.47 | 17.78,27.64 18.44,26.98 18.44,24.07 R7.1 | 17.51,23.24 R7.1 | v32.51,16.15 32.49,16.13 v19.05,16.13 | v19.74,21.06 17.65,23.14 R7.1
  Top 0.305: v5.61,35.81 5.61,34.97
  Bottom 0.178: IC1.P$17
  Bottom 0.254: v32.51,16.15 36.3,16.15 37.72,14.86 37.72,1.98 35.38,0.53 20.7,0.53 20.32,0.91 JP1.3 20.32,4.83 19.55,5.6 IC1.P$17 | v19.05,16.13 19.05,20.37 v19.74,21.06
  Bottom 0.305: v5.61,35.81 7.49,33.98 12.57,33.98 12.93,33.63 v12.93,27.64
VCC  (via drill 0.36)
  Top 0.203: 8.13,2.9 Q6.3 8.12,3.03 | 8.12,9.15 Q5.3 | Q2.3 | 8.13,21.2 Q3.3
  Top 0.254: 14.3,29.64 v14.33,29.67 | 8.13,21.2 8.61,21.69 | Q3.3
  Top 0.305: v18.72,2.44 18.44,2.44 16.82,0.81 15.06,0.81 14.55,1.32 14.55,2.52 12.93,4.14 9.91,4.14 8.66,2.9 8.13,2.9 | 8.12,3.03 7.62,3.53 6.07,3.53 5.36,4.24 v5.36,4.78 | 8.12,9.15 7.62,9.65 6.07,9.65 5.39,9.65 v5.36,9.68 | Q4.3 7.62,15.95 5.69,15.95 v5.36,16.28 5.03,16.61 2.9,16.61 2.64,16.87 2.64,18.64 2.87,18.87 8.26,18.87 8.71,19.33 8.71,20.6 Q3.3 | 14.3,29.64 13.72,29.64 12.12,28.04 12.12,25.86 11.61,25.35 8.84,25.35 7.72,26.47 v7.57,26.47 7.19,26.47 Q2.3 | 8.61,21.69 v8.61,23.65 | Q1.3 13.38,33.21 v14.05,32.54
  Bottom 0.203: v18.72,2.44 18.57,2.46 JP1.4
  Bottom 0.254: IC1.P$18 19.05,5.59 18.26,4.8 | 16.37,4.8 C1.1 | JP1.4 18.14,2.82 | 5.77,26.47 BAT1.3 | v7.57,26.47 7.72,26.47 7.98,26.21 8.61,25.58 | 14.33,29.72 v14.33,29.67
  Bottom 0.305: v5.36,4.78 v5.36,9.68 v5.36,16.28 | v8.61,23.65 8.61,25.58 | v7.57,26.47 5.77,26.47 | v14.05,32.54 13.97,32.46 13.97,30.07 14.33,29.72 | 18.26,4.8 17.91,4.45 | 17.91,4.45 16.97,4.45 16.72,4.69 C1.1 | 17.91,4.45 17.91,2.46 JP1.4

### Text on the board
tPlace: nullspacelabs.com
bPlace: RST | GND | SCK | RST | MISO | MOSI | VCC